# EAGLE design Illuminator (EAGLE 9.6.2)
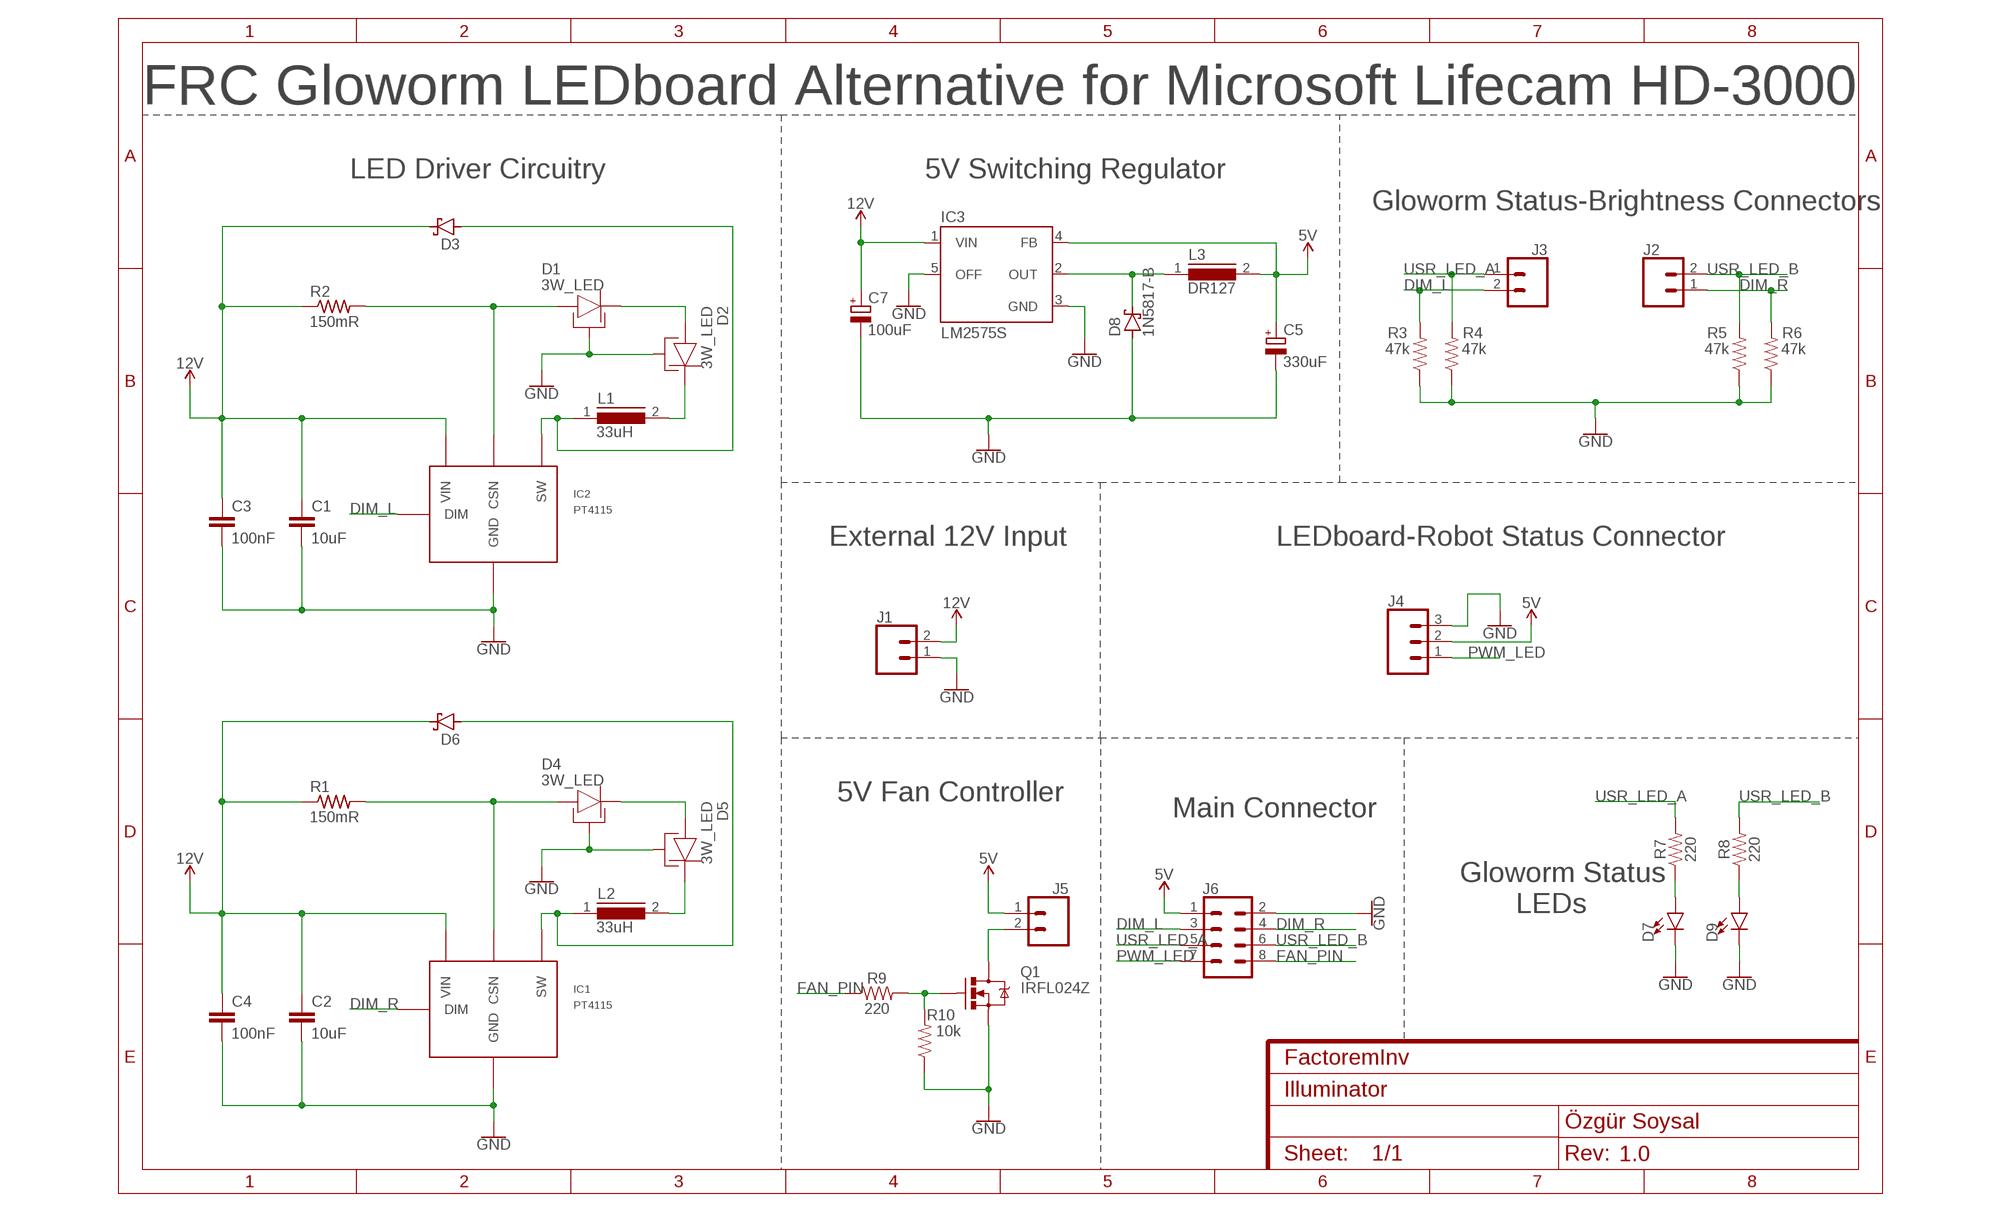
[diagram p0: schematic, sheet 1]
FRAME1 (FRAME-A4L): CNAME: FactoremInv; CREVISION: 1.0; DESIGNER: Özgür Soysal

## Parts
C1  10uF  10UF-1206-6.3V-20%  [1206]
C2  10uF  10UF-1206-6.3V-20%  [1206]
C3  100nF  1.0UF-0805-25V-(+80/-20%)  [0805]
C4  100nF  1.0UF-0805-25V-(+80/-20%)  [0805]
C5  330uF  C-POL_ECAP-10.5MM  [CAPAE1030X1050N]
C7  100uF  C-POL_ECAP-8.5MM  [CAPAE830X1050N]
D1  3W_LED  [3W_LED]
D2  3W_LED  [3W_LED]
D3  SCHOTTKY-DIODESMD  [SMB]
D4  3W_LED  [3W_LED]
D5  3W_LED  [3W_LED]
D6  SCHOTTKY-DIODESMD  [SMB]
D7  LED1206  [LED-1206]
D8  1N5817-B  [DO41-7.6]
D9  LED1206  [LED-1206]
IC1  PT4115  [PT4115]
IC2  PT4115  [PT4115]
IC3  LM2575S  [TO263-5]
J1  CONN_02SPRING-2.54-RA  [SPRINGTERMINAL-2.54MM-2]
J2  CONN_02  [1X02]
J3  CONN_02  [1X02]
J4  CONN_03  [1X03]
J5  CONN_02  [1X02]
J6  CONN_04X2  [2X4]
L1  33uH  DR125  [DR125]
L2  33uH  DR125  [DR125]
L3  DR127  [DR127]
Q1  IRFL024Z  MOSFET-NCHANNEL-SOT-223  [SOT-223]
R1  150mR  R-US_R2512  [R2512]
R2  150mR  R-US_R2512  [R2512]
R3  47k  RESISTOR0805  [0805]
R4  47k  RESISTOR0805  [0805]
R5  47k  RESISTOR0805  [0805]
R6  47k  RESISTOR0805  [0805]
R7  220  RESISTOR1206  [1206]
R8  220  RESISTOR1206  [1206]
R9  220  RESISTOR1206  [1206]
R10  10k  RESISTOR1206  [1206]

## Nets
5V: C5.1(+) IC3.4(FB) J4.2 J5.1 J6.1 L3.2
12V: C1.1 C2.1 C3.1 C4.1 C7.1(+) D3.C D6.C IC1.5(VIN) IC2.5(VIN) IC3.1(VIN) J1.2 R1.1 R2.1
DIM_L: IC2.3(DIM) J3.2 J6.3 R3.2
DIM_R: IC1.3(DIM) J2.1 J6.4 R6.2
FAN_PIN: J6.8 R9.1
GND: C1.2 C2.2 C3.2 C4.2 C5.2(-) C7.2(-) D1.B_PAD D2.B_PAD D4.B_PAD D5.B_PAD D7.C D8.A D9.C IC1.2(GND) IC1.2A(GND) IC2.2(GND) IC2.2A(GND) IC3.3(GND) IC3.5(OFF) J1.1 J4.3 J6.2 Q1.3(S) R3.1 R4.1 R5.1 R6.1 R10.1
N$1: D4.ANODE IC1.4(CSN) R1.2
N$2: D1.ANODE IC2.4(CSN) R2.2
N$3: D1.CATHODE D2.ANODE
N$4: D3.A IC2.1(SW) L1.1
N$5: D2.CATHODE L1.2
N$6: D4.CATHODE D5.ANODE
N$7: D6.A IC1.1(SW) L2.1
N$8: D5.CATHODE L2.2
N$10: D8.C IC3.2(OUT) L3.1
N$12: D7.A R7.1
N$13: D9.A R8.1
N$14: Q1.1(G) R9.2 R10.2
N$16: J5.2 Q1.2(D) Q1.4(D)
PWM_LED: J4.1 J6.7
USR_LED_A: J3.1 J6.5 R4.2 R7.2
USR_LED_B: J2.2 J6.6 R5.2 R8.2

## Notes on the sheet
- FRC Gloworm LEDboard Alternative for Microsoft Lifecam HD-3000
- LED Driver Circuitry | 5V Switching Regulator
- Gloworm Status-Brightness Connectors
- External 12V Input | LEDboard-Robot Status Connector
- 5V Fan Controller
- Main Connector
- Gloworm Status
         LEDs

## Library data of the parts
C1 C2 = SparkFun-Capacitors:10UF: 10.0µF ceramic capacitors A capacitor is a passive two-terminal electrical component used to store electrical energy temporarily in an electric field.; PROD_ID: CAP-10057
C3 C4 = SparkFun-Capacitors:1.0UF: 1µF ceramic capacitors A capacitor is a passive two-terminal electrical component used to store electrical energy temporarily in an electric field.; PROD_ID: CAP-11625; VALUE: 1.0uF
C5 C7 = Capacitor:C-POL: Capacitor Polarised - Generic; CATEGORY: Capacitor
D1 D2 D4 D5 = FRC Components:3W_LED
D3 D6 = diode:SCHOTTKY-DIODE: Schottky Diode
D7 D9 = SparkFun-LED:LED: LED (Generic) Standard schematic elements and footprints for 5mm, 3mm, 1206, and 0603 sized LEDs. Generic LEDs with no color specified.
D8 = diode:1N581*: 1.0A SCHOTTKY BARRIER RECTIFIER Source: http://www.diodes.com/datasheets/ds23001.pdf
IC1 IC2 = PT4115:PT4115: 30V, 1.2A Step-down High Brightness LED Driver with 5000:1 Dimming PDF: http://www.google.pl/url?sa=t&rct=j&q=PT4115&source=web&cd=1&ved=0CC4QFjAA&url=http%3A%2F%2Fwww.micro-bridge.com%2Fdata%2FCRpowtech%2FPT4115E.pdf&ei=9NbxUKXPJNSzhAem2oGoAQ&usg=AFQjCNEsPWIIWjIVjxpF5YN6SPR3coTTpw&bvm=bv.1357700187,d.d2k
IC3 = v-reg-3:LM2575: National Semiconductor <http://www.national.com> 1.0A "Simple Switcher"(c) 52kHz, Vout 1.23-37V (HV: 57V), Vin 40V (HV: 60V), 50µA standby current
J1-J3 J5 = SparkFun-Connectors:CONN_02: Multi connection point. Often used as Generic Header-pin footprint for 0.1 inch spaced/style header connections On any of the 0.1 inch spaced packages, you can populate with these: Break Away Headers - Straight <https://www.sparkfun.com/products/116> (PRT-00116) Break Away Male Headers - Right Angle <https://www.sparkfun.com/products/553> (PRT-00553) Female Headers <https://www.sparkfun.com/products/115> (PRT-00115) Break Away Headers - Machine Pin <https://www.sparkfun.com/products/117> (PRT-00117) Break Away Female Headers - Swiss Machine Pin <https://www.sparkfun.com/products/743> (PRT-00743) For SCREWTERMINALS and SPRING TERMINALS visit here: Screw Terimnals on SparkFun.com <https://www.sparkfun.com/search/results?term=Screw+Terminals> (5mm/3.5mm/2.54mm spacing) This device is also useful as a general connection point to wire up your design to another part of your project. Our various solder wires solder well into these plated through hole pads. Hook-Up Wire - Assortment (Stranded, 22 AWG) <https://www.sparkfun.com/products/11375> (PRT-11375) Hook-Up Wire - Assortment (Solid Core, 22 AWG) <https://www.sparkfun.com/products/11367> (PRT-11367) View the entire wire category on our website here <https://www.sparkfun.com/categories/141> Special notes: Molex polarized connector foot print use with: PRT-08233 with associated crimp pins and housings. 2.54_SCREWTERM for use with PRT-10571. 3.5mm Screw Terminal footprints for PRT-08084 5mm Screw Terminal footprints for use with PRT-08432
J4 = SparkFun-Connectors:CONN_03: Multi connection point. Often used as Generic Header-pin footprint for 0.1 inch spaced/style header connections On any of the 0.1 inch spaced packages, you can populate with these: Break Away Headers - Straight <https://www.sparkfun.com/products/116> (PRT-00116) Break Away Male Headers - Right Angle <https://www.sparkfun.com/products/553> (PRT-00553) Female Headers <https://www.sparkfun.com/products/115> (PRT-00115) Break Away Headers - Machine Pin <https://www.sparkfun.com/products/117> (PRT-00117) Break Away Female Headers - Swiss Machine Pin <https://www.sparkfun.com/products/743> (PRT-00743) Stackable Header - 3 Pin (Female, 0.1") <https://www.sparkfun.com/products/13875> (PRT-13875) For SCREWTERMINALS and SPRING TERMINALS visit here: Screw Terimnals on SparkFun.com <https://www.sparkfun.com/search/results?term=Screw+Terminals> (5mm/3.5mm/2.54mm spacing) This device is also useful as a general connection point to wire up your design to another part of your project. Our various solder wires solder well into these plated through hole pads. Hook-Up Wire - Assortment (Stranded, 22 AWG) <https://www.sparkfun.com/products/11375> (PRT-11375) Hook-Up Wire - Assortment (Solid Core, 22 AWG) <https://www.sparkfun.com/products/11367> (PRT-11367) View the entire wire category on our website here <https://www.sparkfun.com/categories/141> Special notes: Molex polarized connector foot print use with SKU : PRT-08232 with associated crimp pins and housings.
J6 = SparkFun-Connectors:CONN_04X2: Multi connection point. Often used as Generic Header-pin footprint for 0.1 inch spaced/style header connections On any of the 0.1 inch spaced packages, you can populate with these: Break Away Headers - Straight <https://www.sparkfun.com/products/116> (PRT-00116) Break Away Male Headers - Right Angle <https://www.sparkfun.com/products/553> (PRT-00553) Female Headers <https://www.sparkfun.com/products/115> (PRT-00115) Break Away Headers - Machine Pin <https://www.sparkfun.com/products/117> (PRT-00117) Break Away Female Headers - Swiss Machine Pin <https://www.sparkfun.com/products/743> (PRT-00743)
L1 L2 = inductors-2:DR125: High Power Density, High Efficiency, Shielded Inductors Source: coiltronics_dr_series.pdf
L3 = inductors-2:DR127: High Power Density, High Efficiency, Shielded Inductors Source: coiltronics_dr_series.pdf
Q1 = fets:MOSFET-NCHANNEL: Generic NMOS footprint
R1 R2 = adafruit:R-US_: RESISTOR, American symbol
R3-R10 = SparkFun-Resistors:RESISTOR: Generic Resistor Package

## Board
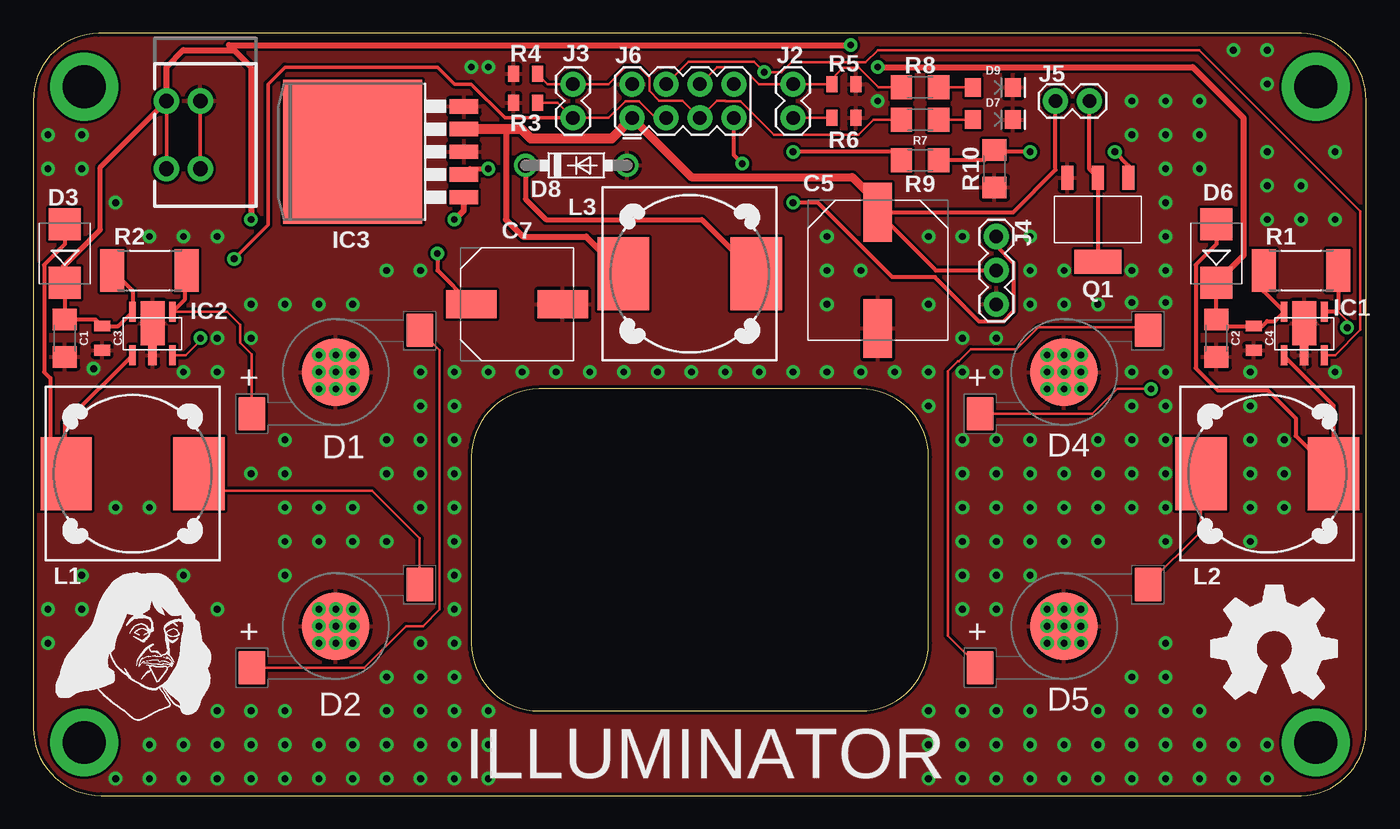
[diagram p1: board, top side]
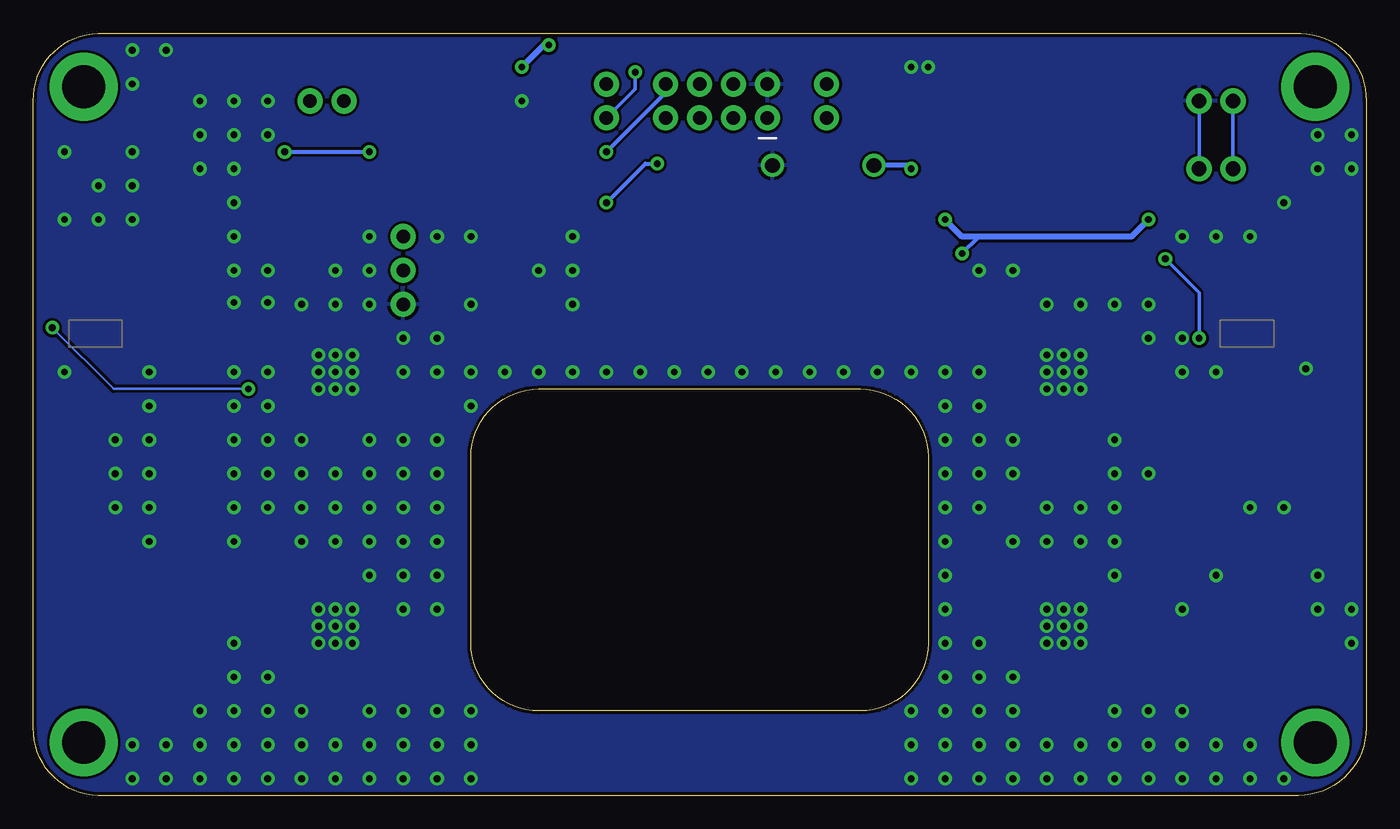
[diagram p2: board, bottom side, seen from below]

Size 99.95 x 57.14 mm. Coordinates in mm from the lower left corner, seen from the top.
Outline: 95.07,57.14 4.9,57.14 arc90 0,52.06 0,5.08 arc90 5.08,0 95.07,0 arc90 99.95,5.08 99.95,52.07 arc90 95.07,57.14
Outline: 32.84,25.4 32.84,11.43 arc90 37.92,6.35 62.05,6.35 arc90 67.13,11.43 67.13,25.4 arc90 62.05,30.48 37.92,30.48 arc90 32.84,25.4
Copper layers (1*16): Top 0.035mm / dielectric 1.5mm / Bottom 0.035mm
Design rules "SparkFun": minimum track width 8mil, minimum drill 20mil, track to track 8mil, track to pad 8mil, pad to pad 8mil, via to via 8mil, smd to smd 8mil, copper to edge 10mil, drill to drill 8mil, minimum pad ring 12mil, minimum via ring 10mil, stop-mask expansion 4mil, vias tented up to drill 25mil, thermal gap 10mil

### Footprints (pad centres in the part's own frame; a part is rotated, then mirrored left to right if it is on the bottom)
1206 = smd 1.6 x 1.8: 1 -1.4,0; 2 1.4,0
0805 = smd 0.8 x 1.2: 1 -0.9,0; 2 0.9,0
CAPAE1030X1050N = smd 4.416 x 2.115: 1 -4.353,0; 2 4.353,0
CAPAE830X1050N = smd 3.764 x 2.115: 1 -3.426,0; 2 3.426,0
3W_LED = smd 2.032 x 2.54: ANODE -6.299,-3.124; CATHODE 6.299,3.124 | smd 5.08 x 5.08: B_PAD 0,0
SMB = smd 2.4 x 2.4: A 2.2,0; C -2.2,0
LED-1206 = smd 1.2 x 1.4: A -1.5,0; C 1.5,0
DO41-7.6 = drill 1.1 pad 1.7: A 3.81,0; C -3.81,0
PT4115 = smd 0.5 x 1.5: 1 0,0; 3 3,0; 4 3,3.25; 5 0,3.25 | smd 0.65 x 1.5: 2 1.5,0 | smd 1.8 x 3.3: 2A 1.5,2.375
TO263-5 = smd 1.067 x 2.159: 1 -3.404,-5.791; 2 -1.702,-5.791; 3 0,-5.791; 4 1.702,-5.791; 5 3.404,-5.791 | smd 10.8 x 10.41: 6 0,2.54
SPRINGTERMINAL-2.54MM-2 = drill 1.1 pad 1.9: 1 0,0; 2 2.54,0; P$2 0,5.08; P$3 2.54,5.08
1X02 = drill 1.016 pad 1.88: 1 0,0; 2 2.54,0
1X03 = drill 1.016 pad 1.88: 1 0,0; 2 2.54,0; 3 5.08,0
2X4 = drill 1.016 pad 1.88: 1 -3.81,-1.27; 2 -3.81,1.27; 3 -1.27,-1.27; 4 -1.27,1.27; 5 1.27,-1.27; 6 1.27,1.27; 7 3.81,-1.27; 8 3.81,1.27
DR125 = smd 3.85 x 5.5: 1 -4.975,0; 2 4.975,0
DR127 = smd 3.85 x 5.5: 1 -4.975,0; 2 4.975,0
SOT-223 = smd 0.9 x 1.8: 1 -2.3,-3.15; 2 0,-3.15; 3 2.3,-3.15 | smd 3.5 x 1.8: 4 0,3.15
R2512 = smd 1.8 x 3.2: 1 -2.8,0; 2 2.8,0

### Placement (x,y rotation side)
C1  2.36,34.29 270 top
C2  88.72,34.29 270 top
C3  5.16,34.29 270 top
C4  91.52,34.29 270 top
C5  63.32,39.37 270 top
C7  36.27,36.83 0 top
D1  22.68,31.75 0 top
D2  22.68,12.7 0 top
D3  2.36,40.64 90 top
D4  77.29,31.75 0 top
D5  77.29,12.7 0 top
D6  88.72,40.64 90 top
D7  71.96,50.67 0 top
D8  40.72,47.24 0 top
D9  71.96,53.09 0 top
IC1  93.8,33.02 0 top
IC2  7.44,33.02 0 top
IC3  26.49,48.26 90 top
J1  12.52,52.07 180 top
J2  56.97,50.8 90 top
J3  40.46,53.34 270 top
J4  72.21,41.91 270 top
J5  76.66,52.07 0 top
J6  48.72,52.07 0 top
L1  7.44,24.13 0 top
L2  92.53,24.13 180 top
L3  49.23,39.12 180 top
Q1  79.83,43.18 180 top
R1  95.07,39.37 0 top
R2  8.71,39.37 0 top
R3  36.91,51.94 0 top
R4  36.91,54.1 0 top
R5  60.78,53.34 180 top
R6  60.78,50.8 180 top
R7  66.5,50.67 180 top
R8  66.5,53.09 180 top
R9  66.5,47.62 0 top
R10  72.09,46.99 90 top

### Tracks (layer width: path | path; a pad name or v marks a point on that pad's centre or on a via)
5V
  Top 0.305: J4.2 67.68,39.37 C5.1 73.48,43.72 76.66,46.9 J5.1
  Top 0.457: L3.2 41.46,41.91 36.72,41.91 35.45,43.18 35.45,49.96
  Top 0.61: J6.1 49.35,46.35 61.42,46.35 63.32,44.45 C5.1
  Top 0.762: J6.1 43.38,49.28 37.29,49.28 36.61,49.96 35.45,49.96 IC3.4
12V  (via drill 0.51)
  Top 0.305: R2.1 7.44,37.84 IC2.5 6.36,35.19 C3.1 4.66,35.69 C1.1 D3.C 2.36,39.37 2.17,39.56 | R1.1 92.27,37.8 IC1.5 93.09,35.56 92.53,35.56 92.16,35.19 C4.1 89.22,35.19 C2.1 D6.C | C7.1 30.3,39.37 v30.3,40.64
  Top 0.381: J1.2 5.03,47.12 5.03,42.42 2.17,39.56
  Top 0.457: J1.2 9.98,54.61 11.25,55.88 15.06,55.88 | v61.29,56.26 14.68,56.26 15.06,55.88 | v63.32,54.61 86.94,54.61 90.75,50.8 90.75,40.47 D6.C | 15.06,55.88 16.33,54.61 v16.33,43.18 | v31.57,43.18 32.28,43.89 IC3.1
  Bottom 0.305: v30.3,40.64 29.03,41.91
  Bottom 0.457: v63.32,54.61 61.67,56.26 v61.29,56.26 | v16.33,43.18 17.6,41.91 29.03,41.91 30.3,41.91 v31.57,43.18
DIM_L  (via drill 0.51)
  Top 0.203: J6.3 46.67,50.8 45.42,52.05 44.39,52.05 43.15,50.8 J3.2 39.32,51.94 R3.2 | IC2.3 11.43,33.02 12.52,34.11 v12.52,34.29
  Top 0.254: v15.06,40.23 17.6,42.77 17.6,53.34 18.87,54.61 30.3,54.61 31.57,53.34 32.84,53.34 35.38,50.8 J3.2
  Bottom 0.254: v12.52,34.29 12.52,37.69 v15.06,40.23
DIM_R  (via drill 0.51)
  Top 0.203: J6.4 49.12,55.02 54.03,55.02 v54.81,54.23 56.1,54.23 56.84,54.97 62.41,54.97 63.32,55.88 87.45,55.88 99.52,43.81 99.52,34.92 97.62,33.02 IC1.3 | J2.1 R6.2
  Bottom 0.254: v54.81,54.23 54.81,52.96 J2.1
FAN_PIN  (via drill 0.51)
  Top 0.305: R9.1 64.46,48.26 v56.97,48.26
  Bottom 0.305: v56.97,48.26 52.53,52.7 J6.8
GND  (via drill 0.51)
  other vias: 32.84,54.61 34.11,54.61 4.52,32 63.32,52.07 91.26,31.75 97.61,31.75 92.53,48.26 22.68,33.02 23.95,33.02 23.95,31.75 22.68,31.75 21.41,31.75 21.41,30.48 22.68,30.48 23.95,30.48 21.41,13.97 22.68,13.97 23.95,13.97 23.95,12.7 22.68,12.7 21.41,12.7 21.41,11.43 22.68,11.43 23.95,11.43 78.56,13.97 77.29,13.97 76.02,13.97 76.02,12.7 77.29,12.7 78.56,12.7 78.56,11.43 77.29,11.43 76.02,11.43 76.02,33.02 77.29,33.02 78.56,33.02 78.56,31.75 77.29,31.75 76.02,31.75 76.02,30.48 77.29,30.48 78.56,30.48 92.53,45.72 92.53,43.18 95.07,43.18 97.61,43.18 95.07,45.72 82.37,52.07 82.37,49.53 84.91,49.53 84.91,52.07 87.45,52.07 87.45,49.53 87.45,46.99 84.91,46.99 84.91,44.45 84.91,41.91 84.91,39.37 82.37,39.37 77.29,39.37 77.29,36.83 79.83,36.83 82.37,36.96 84.91,36.96 74.75,36.83 74.75,39.37 74.75,41.91 72.21,34.29 72.21,31.75 69.67,34.29 69.67,31.75 67.13,29.21 67.13,31.75 64.59,31.75 69.67,26.67 69.67,24.13 69.67,21.59 72.21,26.67 74.75,24.13 77.29,21.59 79.83,19.05 77.29,19.05 74.75,19.05 72.21,19.05 69.67,19.05 72.21,24.13 72.21,21.59 74.75,21.59 74.75,16.51 72.21,16.51 69.67,16.51 69.67,13.97 72.21,13.97 84.91,31.75 82.37,31.75 84.91,29.21 82.37,29.21 79.83,26.67 82.37,26.67 84.91,26.67 84.91,24.13 82.37,24.13 79.83,24.13 82.37,21.59 84.91,21.59 84.91,19.05 91.26,29.21 91.26,26.67 91.26,24.13 91.26,21.59 91.26,19.05 93.8,21.59 93.8,24.13 93.8,26.67 21.41,33.02 16.33,34.29 13.79,31.75 11.25,31.75 18.87,36.83 16.33,36.83 13.79,34.29 21.41,36.83 23.95,36.83 29.03,31.75 31.57,31.75 34.11,31.75 36.65,31.75 39.19,31.75 41.73,31.75 44.27,31.75 46.81,31.75 49.35,31.75 51.89,31.75 54.43,31.75 56.97,31.75 59.51,31.75 62.05,31.75 59.51,36.83 59.51,39.37 59.51,41.91 62.05,39.37 67.13,36.83 67.13,41.91 69.67,41.91 92.53,3.81 89.99,3.81 87.45,3.81 92.53,1.27 89.99,1.27 87.45,1.27 84.91,1.27 84.91,3.81 84.91,6.35 84.91,8.89 82.37,6.35 82.37,3.81 82.37,1.27 79.83,1.27 79.83,3.81 79.83,6.35 77.29,1.27 77.29,3.81 74.75,6.35 74.75,3.81 74.75,1.27 72.21,6.35 69.67,6.35 67.13,6.35 67.13,3.81 67.13,1.27 69.67,1.27 72.21,1.27 72.21,3.81 69.67,3.81 31.57,29.21 29.03,29.21 26.49,26.67 29.03,26.67 31.57,26.67 31.57,24.13 29.03,24.13 31.57,21.59 31.57,19.05 26.49,24.13 29.03,21.59 31.57,16.51 31.57,13.97 31.57,11.43 29.03,11.43 26.49,8.89 26.49,6.35 29.03,8.89 31.57,8.89 31.57,6.35 29.03,6.35 34.11,3.81 34.11,1.27 34.11,6.35 31.57,1.27 31.57,3.81 29.03,3.81 26.49,3.81 29.03,1.27 26.49,1.27 23.95,1.27 23.95,3.81 21.41,3.81 21.41,1.27 18.87,1.27 18.87,3.81 16.33,1.27 16.33,3.81 13.79,1.27 11.25,1.27 8.71,1.27 6.17,1.27 8.71,3.81 11.25,3.81 13.79,3.81 8.71,21.59 6.17,21.59 23.95,21.59 26.49,19.05 23.95,19.05 21.41,19.05 18.87,16.51 18.87,19.05 18.87,21.59 16.33,24.13 18.87,24.13 21.41,21.59 18.87,26.67 26.49,39.37 29.03,39.37 13.79,41.91 11.25,41.91 8.71,41.91 6.17,44.45 3.63,49.53 1.09,49.53 1.09,46.99 3.63,46.99 82.37,8.89 79.83,21.59 77.29,24.13 74.75,26.67 87.45,6.35 84.91,11.43 16.33,6.35 13.79,6.35 13.79,13.97 11.25,16.51 3.63,13.97 1.09,13.97 1.09,11.43 3.63,16.51 18.87,6.35 97.61,48.26 89.99,55.88 92.53,53.34 92.53,55.88
  pour Bottom: -3.18,53.33 -3.18,-1.54 -2.72,-2 101.63,-2 102.82,-0.81 102.82,54.14 98.09,58.87 2.36,58.87
  pour Top: -5.26,-3.81 105.23,-3.81 105.23,60.96 -5.26,60.96
N$1  (via drill 0.51)
  Top 0.203: D4.ANODE 79.43,28.63 81.28,30.48 v83.82,30.48 | v98.53,35.08 98.53,35.59 97.84,36.27 IC1.4
  Top 0.305: IC1.4 97.61,36.27 97.87,36.53 R1.2
  Bottom 0.203: v83.82,30.48 93.93,30.48 v98.53,35.08
N$2
  Top 0.203: D1.ANODE 16.38,33.09 15.52,33.95 15.52,35.28 14.53,36.27 IC2.4
  Top 0.305: R2.2 11.38,39.24 11.38,37.21 IC2.4
N$3
  Top 0.203: D2.ANODE 24.82,9.58 27.94,12.7 29.21,12.7 30.48,13.97 30.48,33.38 D1.CATHODE
N$4
  Top 0.305: IC2.1 2.36,27.94 2.36,24.13 L1.1 1.27,25.33 1.27,31.29 0.81,31.75 0.81,39.79 2.36,41.34 D3.A
N$5
  Top 0.203: D2.CATHODE 28.98,19.28 25.4,22.86 13.69,22.86 L1.2
N$6
  Top 0.203: D5.ANODE 68.58,11.99 68.58,31.81 69.34,32.56 69.39,32.56 70.31,33.48 73.73,33.48 75.35,35.1 83.36,35.1 D4.CATHODE
N$7
  Top 0.305: IC1.1 93.8,32.94 97.51,29.24 L2.1 94.67,26.97 94.67,28.3 92.59,30.38 88.83,30.38 87.17,32.04 87.17,39.79 88.72,41.34 D6.A
N$8
  Top 0.203: D5.CATHODE 87.56,19.79 L2.2
N$10  (via drill 0.51)
  Top 0.381: IC3.2 32.72,46.99 v34.11,46.99 | D8.C 36.91,44.7 38.43,43.18 50.14,43.18 L3.1
  Bottom 0.381: v34.11,46.99 34.37,47.24 D8.C
N$11  (via drill 3.2 pad 5.08)
  other vias: 3.81,53.14
N$12
  Top 0.203: R7.1 D7.A
N$13
  Top 0.203: R8.1 D9.A
N$14  (via drill 0.51)
  Top 0.305: Q1.1 82.13,47.23 v81.1,48.26 | v74.75,48.26 72.22,48.26 R10.2 71.32,47.62 R9.2
  Bottom 0.305: v81.1,48.26 v74.75,48.26
N$15  (via drill 3.2 pad 5.08)
  other vias: 96.16,53.14
N$16
  Top 0.305: Q1.4 Q1.2 79.2,46.97 J5.2
N$17  (via drill 3.2 pad 5.08)
  other vias: 3.81,3.99
N$18  (via drill 3.2 pad 5.08)
  other vias: 96.16,3.99
PWM_LED  (via drill 0.51)
  Top 0.305: J4.1 72.21,41.2 73.51,39.91 73.51,36.29 72.75,35.53 70.94,35.53 67.62,38.86 64.42,38.86 58.83,44.45 v56.97,44.45 | v53.16,47.37 52.53,48.01 J6.7
  Bottom 0.305: v56.97,44.45 54.05,47.37 v53.16,47.37
USR_LED_A
  Top 0.203: R4.2 38.57,53.34 J3.1 43.15,53.34 44.39,54.59 45.42,54.59 46.2,53.8 46.2,52.82 46.93,52.09 48.69,52.09 J6.5 51.26,52.07 51.89,52.07 51.92,52.05 53.04,52.05 55.53,49.55 61.87,49.55 62.99,50.67 R7.2
USR_LED_B
  Top 0.203: J6.6 51.26,54.61 53.16,54.61 54.43,53.34 J2.2 59.51,53.34 | 59.51,53.34 R5.2 | R8.2 63.37,53.09 61.89,54.56 60.73,54.56 59.51,53.34

### Text on the board
tPlace: ILLUMINATOR